# EAGLE design MJfoo - rev.1 - TCAN334 - poc (EAGLE 9.6.2)
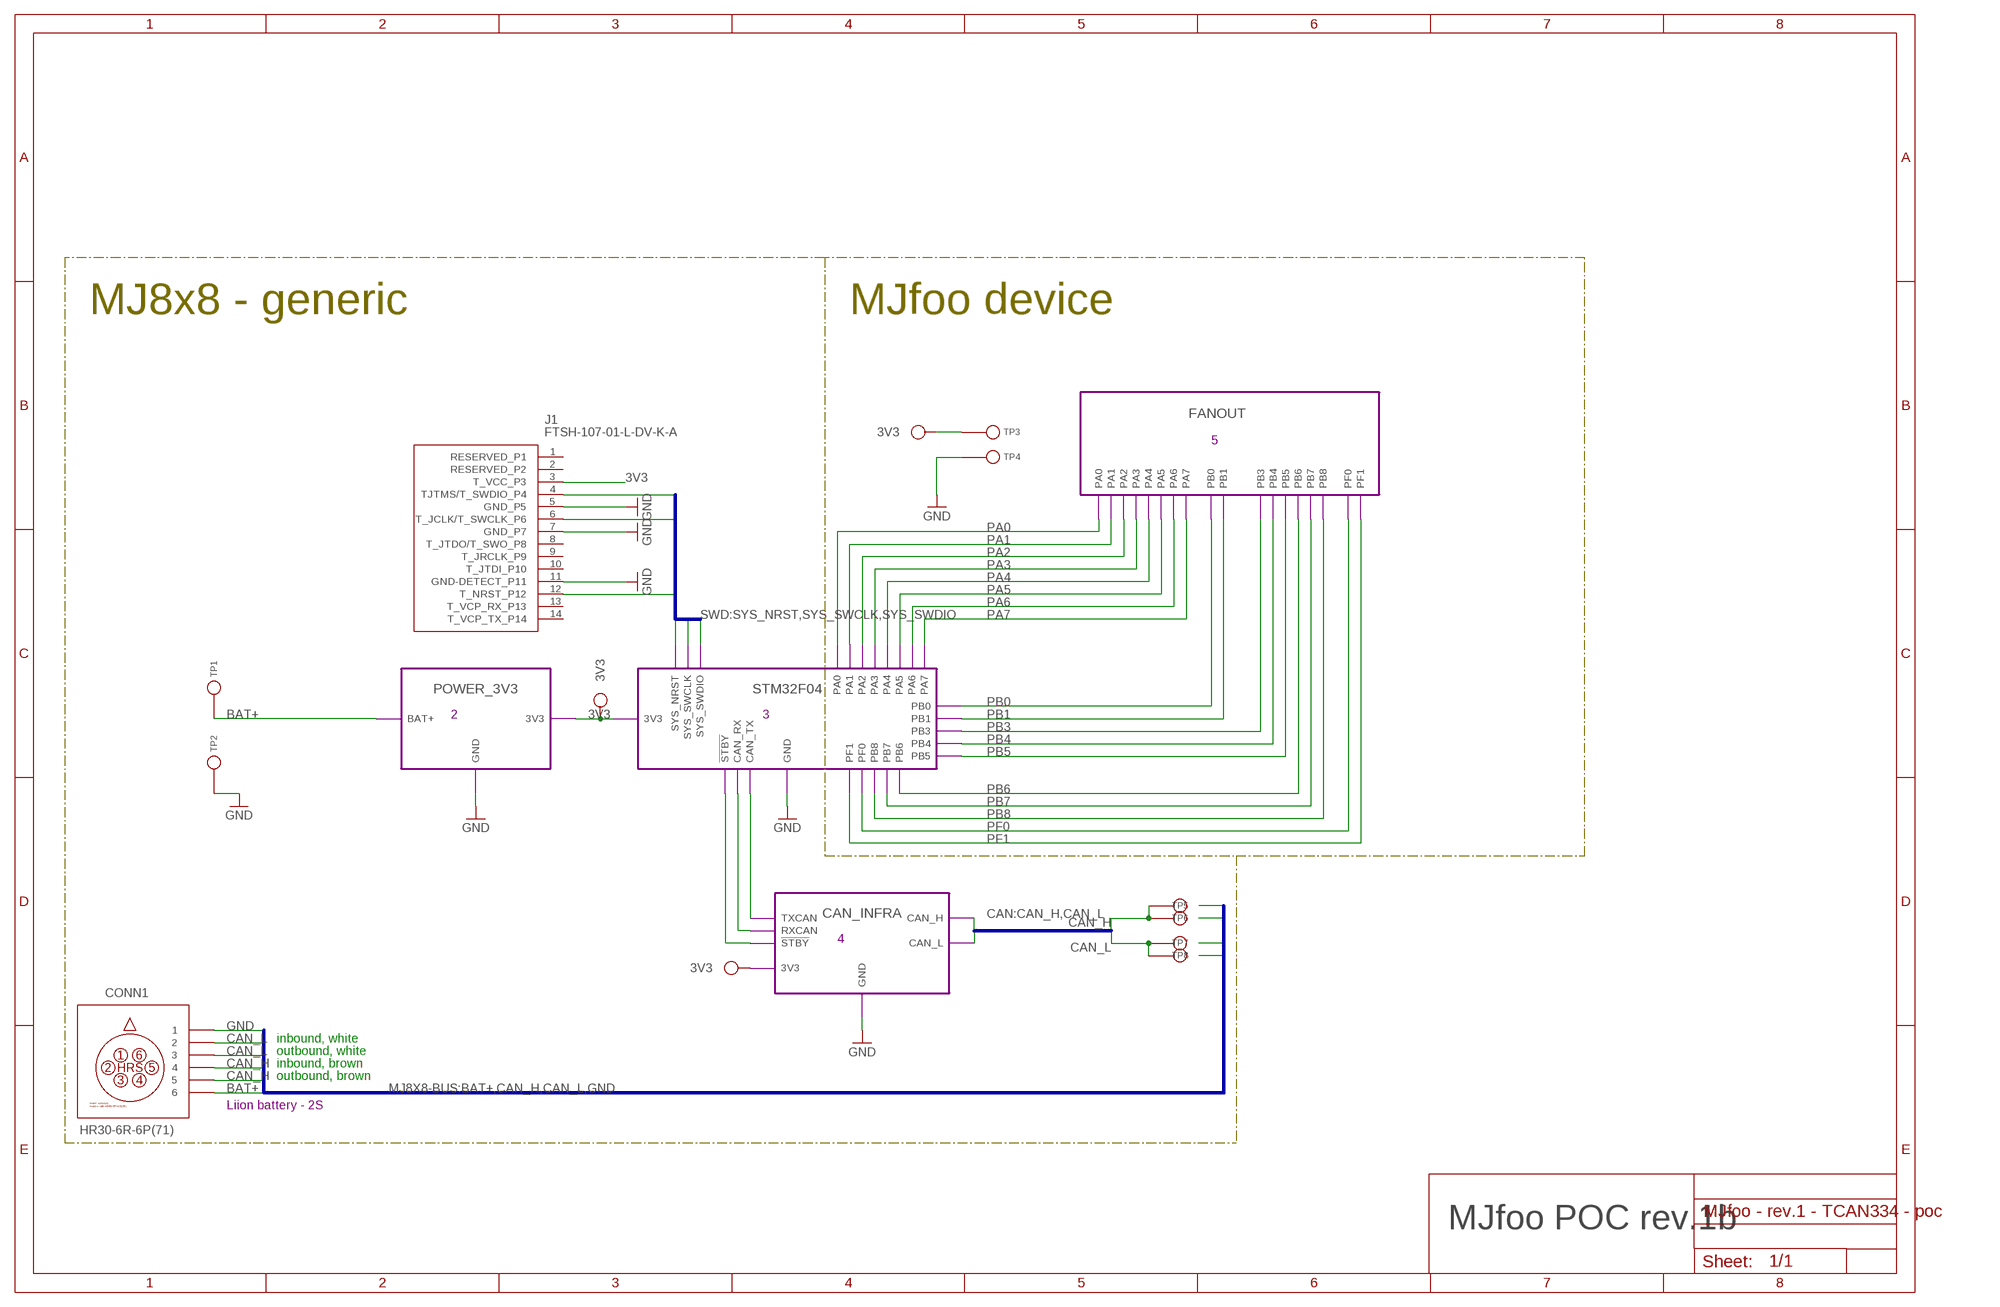
[diagram p0: schematic, sheet 1]

## Parts
CONN1  HR30-6R-6P(71)  HR-30-6R-6X  (no package)
J1  FTSH-107-01-L-DV-K-A  [FTSH10701LDVKA]
TP1  LiIon + Terminal  TPTH-0.9  [TH-0.9]
TP2  LiIon - Terminal  TPTH-0.9  [TH-0.9]
TP3  LiIon - Terminal  TPTH-0.9  [TH-0.9]
TP4  LiIon - Terminal  TPTH-0.9  [TH-0.9]
TP5  CAN high  TPTH-0.9  [TH-0.9]
TP6  CAN high  TPTH-0.9  [TH-0.9]
TP7  CAN low  TPTH-0.9  [TH-0.9]
TP8  CAN low  TPTH-0.9  [TH-0.9]

## Module instances
POWER_3V3 = POWER_3V3 (part numbers offset by 200)
STM32F04 = STM32 (part numbers offset by 300)
CAN_INFRA = CAN_INFRA (part numbers offset by 400)
FANOUT = FANOUT (part numbers offset by 500)

## Nets
3V3 [3V3]: J1.3(T_VCC_P3) TP3.P$1(TP$1) ; port CAN_INFRA.3V3 POWER_3V3.3V3 STM32F04.3V3
!STBY! [signal]: port CAN_INFRA.!STBY! STM32F04.!STBY!
BAT+ [BAT+]: CONN1.6 TP1.P$1(TP$1) ; port POWER_3V3.BAT+
CAN_H [signal]: CONN1.4 CONN1.5 TP5.P$1(TP$1) TP6.P$1(TP$1) ; port CAN_INFRA.CAN_H
CAN_L [signal]: CONN1.2 CONN1.3 TP7.P$1(TP$1) TP8.P$1(TP$1) ; port CAN_INFRA.CAN_L
CAN_RX [signal]: port CAN_INFRA.RXCAN STM32F04.CAN_RX
CAN_TX [signal]: port CAN_INFRA.TXCAN STM32F04.CAN_TX
GND: CONN1.1 J1.5(GND_P5) J1.7(GND_P7) J1.11(GND-DETECT_P11) TP2.P$1(TP$1) TP4.P$1(TP$1) ; port STM32F04.GND POWER_3V3.GND CAN_INFRA.GND
PA0 [signal]: port FANOUT.PA0 STM32F04.PA0
PA1 [signal]: port STM32F04.PA1 FANOUT.PA1
PA2 [signal]: port FANOUT.PA2 STM32F04.PA2
PA3 [signal]: port FANOUT.PA3 STM32F04.PA3
PA4 [signal]: port FANOUT.PA4 STM32F04.PA4
PA5 [signal]: port FANOUT.PA5 STM32F04.PA5
PA6 [signal]: port FANOUT.PA6 STM32F04.PA6
PA7 [signal]: port FANOUT.PA7 STM32F04.PA7
PB0 [signal]: port FANOUT.PB0 STM32F04.PB0
PB1 [signal]: port STM32F04.PB1 FANOUT.PB1
PB3 [signal]: port STM32F04.PB3 FANOUT.PB3
PB4 [signal]: port STM32F04.PB4 FANOUT.PB4
PB5 [signal]: port STM32F04.PB5 FANOUT.PB5
PB6 [signal]: port FANOUT.PB6 STM32F04.PB6
PB7 [signal]: port FANOUT.PB7 STM32F04.PB7
PB8 [signal]: port FANOUT.PB8 STM32F04.PB8
PF0 [signal]: port FANOUT.PF0 STM32F04.PF0
PF1 [signal]: port FANOUT.PF1 STM32F04.PF1
SYS_NRST [signal]: J1.12(T_NRST_P12) ; port STM32F04.SYS_NRST
SYS_SWCLK [signal]: J1.6(T_JCLK/T_SWCLK_P6) ; port STM32F04.SYS_SWCLK
SYS_SWDIO [signal]: J1.4(TJTMS/T_SWDIO_P4) ; port STM32F04.SYS_SWDIO
Unconnected: J1.1(RESERVED_P1) J1.2(RESERVED_P2) J1.8(T_JTDO/T_SWO_P8) J1.9(T_JRCLK_P9) J1.10(T_JTDI_P10) J1.13(T_VCP_RX_P13) J1.14(T_VCP_TX_P14)

## Buses
CAN:CAN_H,CAN_L
SWD:SYS_NRST,SYS_SWCLK,SYS_SWDIO
MJ8X8-BUS:BAT+,CAN_H,CAN_L,GND

## Notes on the sheet
- MJ8x8 - generic | MJfoo device
- 5
- 2 | 3
- 4
- inbound, white
- outbound, white
- inbound, brown
- outbound, brown
- Liion battery - 2S
- MJfoo POC rev.1b

## Library data of the parts
CONN1 = HR30-6R-6P - PushPull Receptacle:HR-30-6R-6X
J1 = STM32 JTAG 1.27mm 14pin header:FTSH-107-01-L-DV-K-A: Headers & Wire Housings .050" Micro Terminal Strip Source: Datasheet <https://componentsearchengine.com/Datasheets/1/FTSH-107-01-L-DV-K-A.pdf>; DESCRIPTION: Headers & Wire Housings .050" Micro Terminal Strip; HEIGHT: 5.97mm; MANUFACTURER_NAME: SAMTEC; MANUFACTURER_PART_NUMBER: FTSH-107-01-L-DV-K-A; MOUSER_PART_NUMBER: 200-FTSH10701LDVKA; MOUSER_PRICE-STOCK: https://www.mouser.com/Search/Refine.aspx?Keyword=200-FTSH10701LDVKA
TP1-TP8 = signal testpoint:TP

## Module POWER_3V3
Ports: GND(pwr) BAT+(pwr) 3V3(pwr)
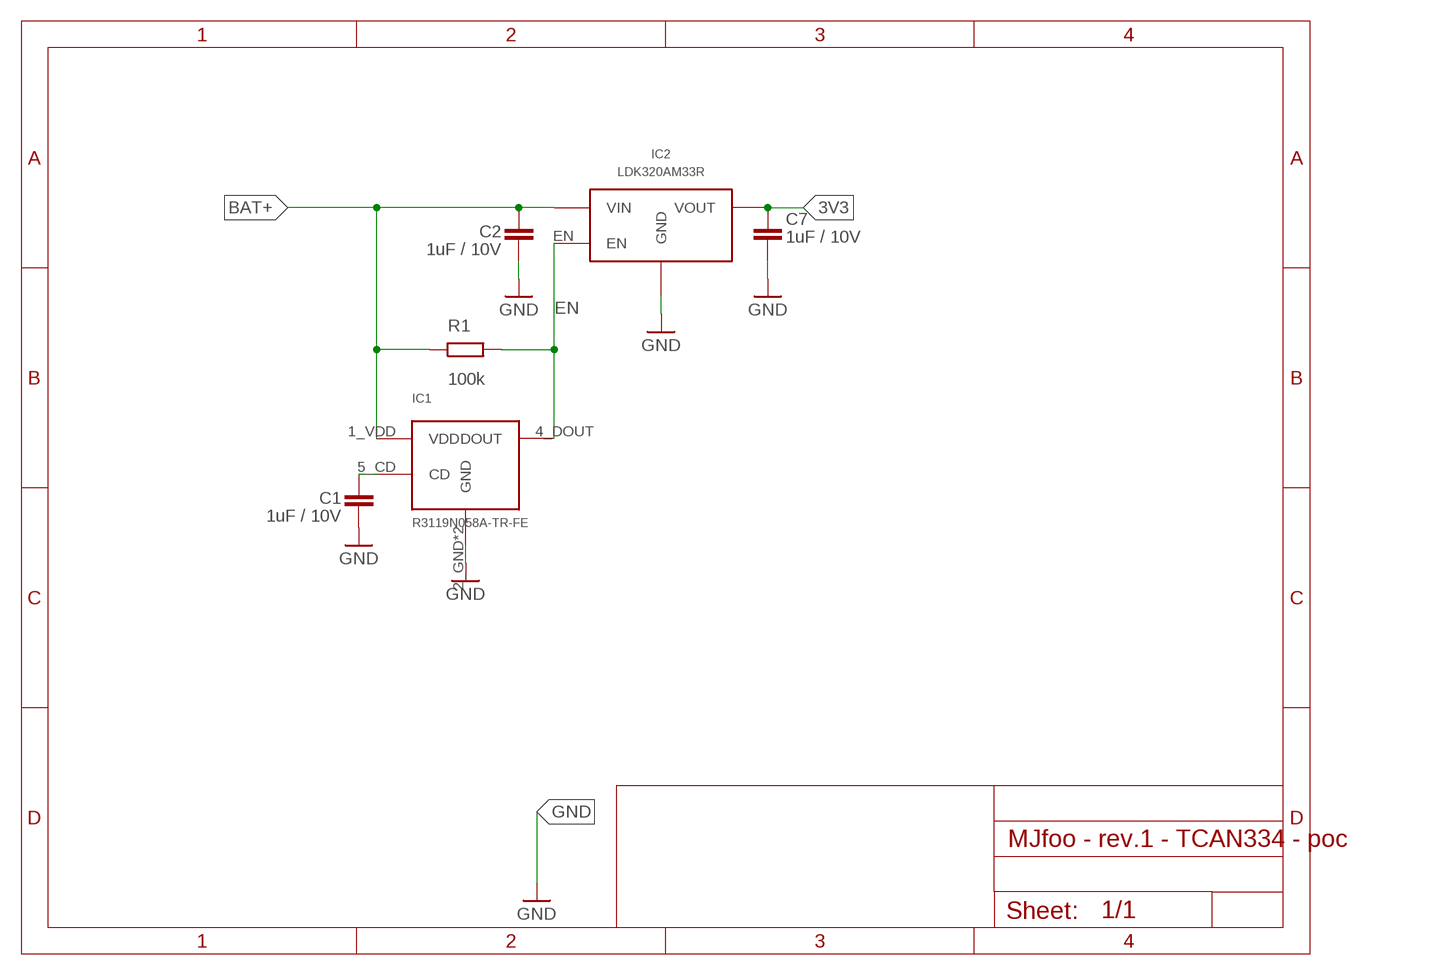
[diagram p1: schematic, module POWER_3V3, sheet 1]

### Parts
C1  1uF / 10V  C-EUC0402  [C0402]
C2  1uF / 10V  C-EUC0402  [C0402]
C7  1uF / 10V  C-EUC0402  [C0402]
IC1  R3119N058A-TR-FE  R3119XXXA  [SOT23-5]
IC2  LDK320AM33R  LDK320SOT-23-5L  [SOT-23-5L]
R1  100k  R-EU_R0402  [R0402]

### Nets
3V3 [3V3]: C7.2 IC2.OUT(VOUT)
BAT+ [BAT+]: C2.1 IC1.1_VDD(VDD) IC2.IN(VIN) R1.1
CD [signal]: C1.1 IC1.5_CD(CD)
EN [signal]: IC1.4_DOUT(DOUT) IC2.EN R1.2
GND: C1.2 C2.2 C7.1 IC1.2_GND(GND) IC1.3_GND(GND) IC2.GND

### Library data of the parts
C1 C2 C7 = rcl:C-EU: CAPACITOR, European symbol; SPICEPREFIX: C
IC1 = R3119x - Input Voltage Detector:R3119XXXA
IC2 = LDK320 5V LDO:LDK320
R1 = rcl:R-EU_: RESISTOR, European symbol; SPICEPREFIX: R

## Module STM32
Ports: GND(pwr) 3V3(pwr) SYS_NRST(in) SYS_SWCLK(io) SYS_SWDIO(io) CAN_RX(in) CAN_TX(out) !STBY!(out) PA0(io) PA1(io) PA2(io) PA3(io) PA4(io) PA5(io) PA6(io) PA7(io) PB0(io) PB1(io) PB3(io) PB4(io) PB5(io) PB6(io) PB7(io) PB8(io) PF0(io) PF1(io)
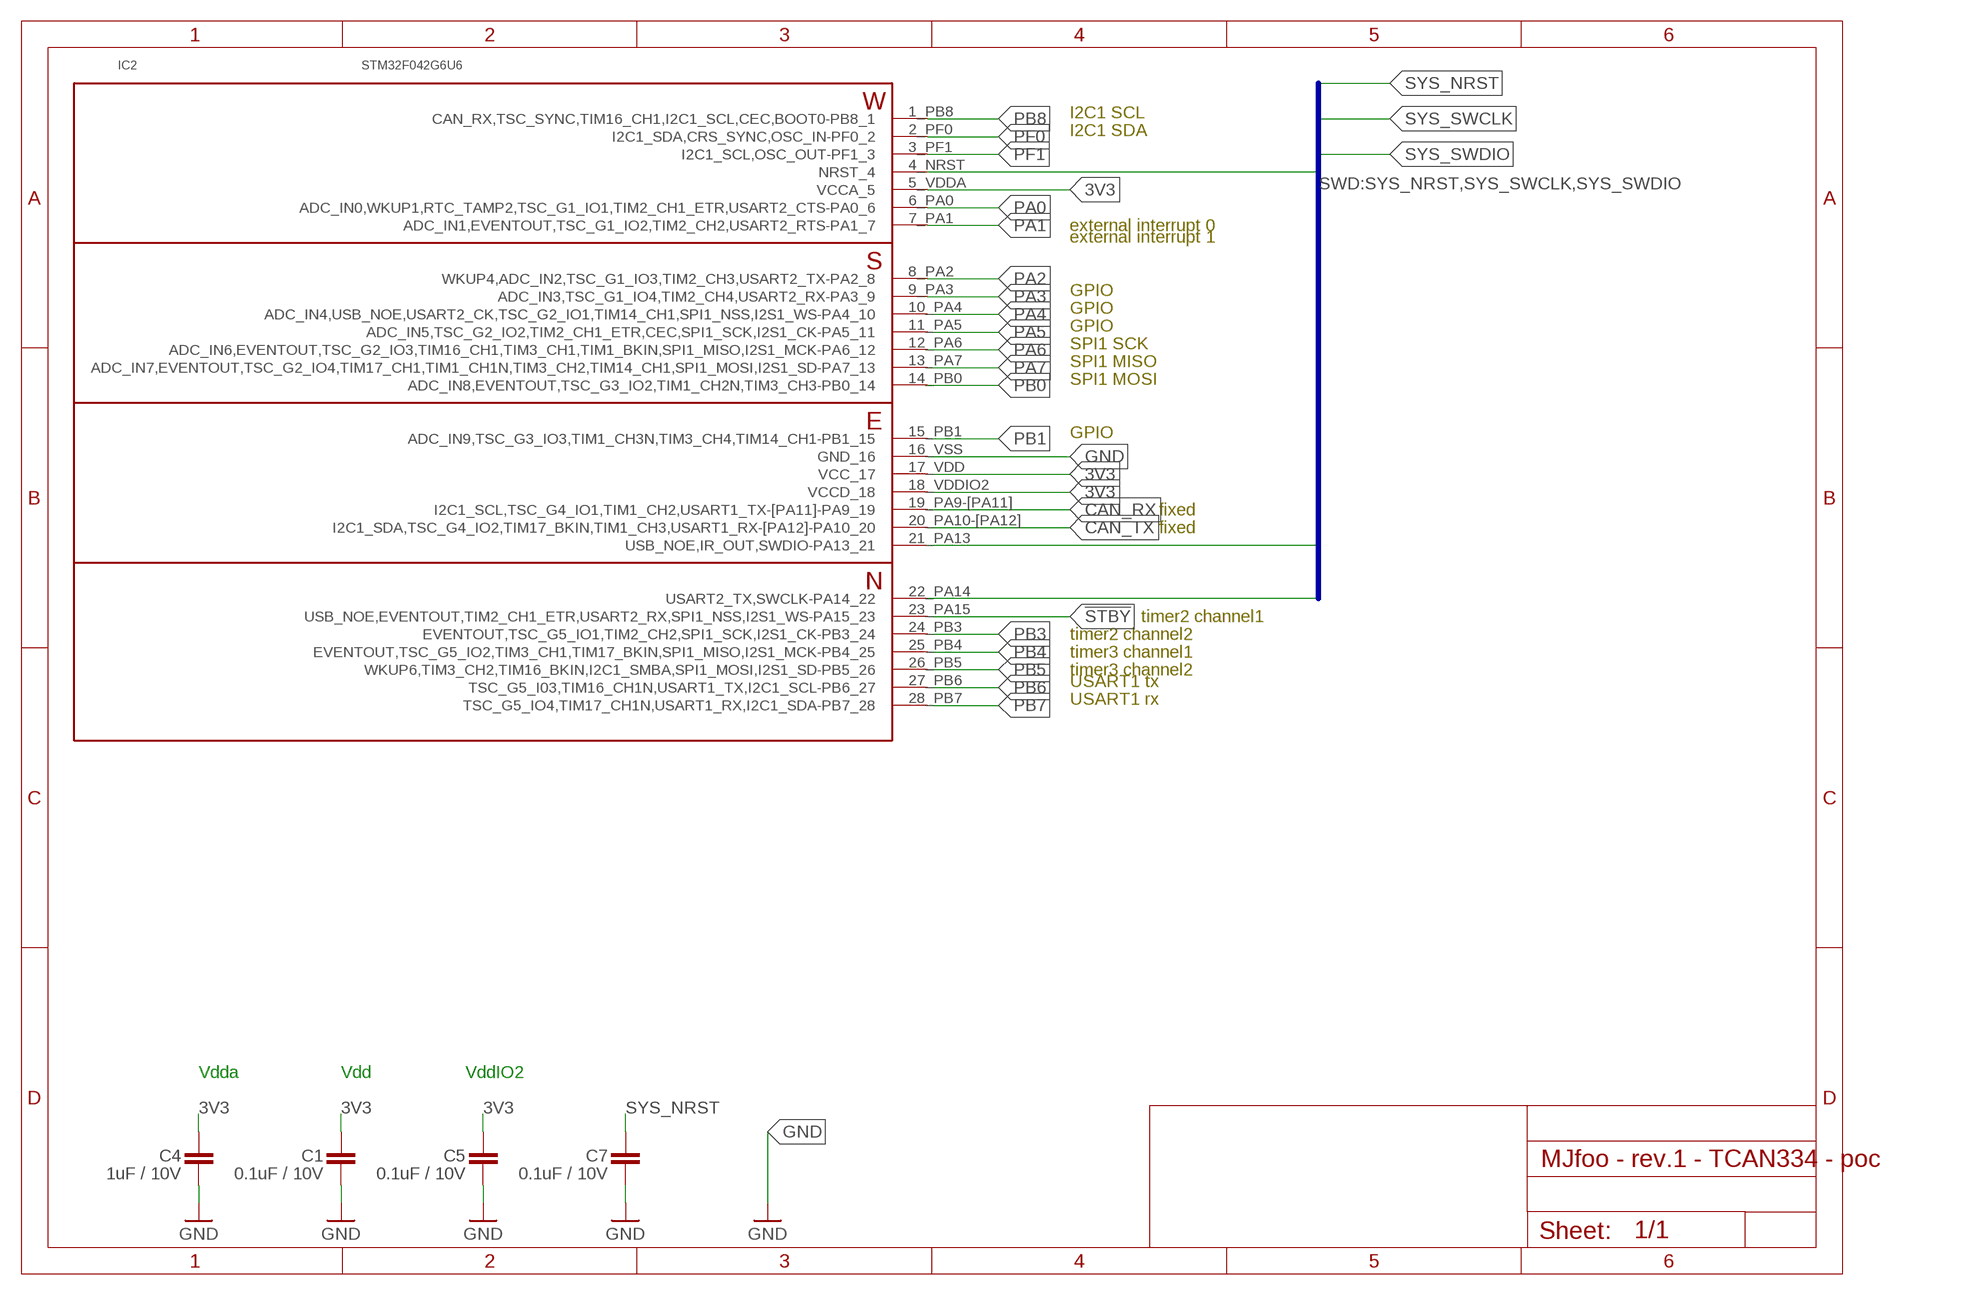
[diagram p2: schematic, module STM32, sheet 1]

### Parts
C1  0.1uF / 10V  C-EUC0402  [C0402]
C4  1uF / 10V  C-EUC0402  [C0402]
C5  0.1uF / 10V  C-EUC0402  [C0402]
C7  0.1uF / 10V  C-EUC0402  [C0402]
IC2  STM32F042G6U6  STM32F042G6  [UFQFPN-28]

### Nets
3V3 [3V3]: C1.2 C4.2 C5.2 IC2.5_VDDA(VCCA_5) IC2.17_VDD(VCC_17) IC2.18_VDDIO2(VCCD_18)
!STBY!: IC2.23_PA15(USB_NOE,EVENTOUT,TIM2_CH1_ETR,USART2_RX,SPI1_NSS,I2S1_WS-PA15_23)
CAN_RX: IC2.19_PA9-[PA11](I2C1_SCL,TSC_G4_IO1,TIM1_CH2,USART1_TX-[PA11]-PA9_19)
CAN_TX: IC2.20_PA10-[PA12](I2C1_SDA,TSC_G4_IO2,TIM17_BKIN,TIM1_CH3,USART1_RX-[PA12]-PA10_20)
GND: C1.1 C4.1 C5.1 C7.1 IC2.16_VSS(GND_16)
PA0: IC2.6_PA0(ADC_IN0,WKUP1,RTC_TAMP2,TSC_G1_IO1,TIM2_CH1_ETR,USART2_CTS-PA0_6)
PA1: IC2.7_PA1(ADC_IN1,EVENTOUT,TSC_G1_IO2,TIM2_CH2,USART2_RTS-PA1_7)
PA2: IC2.8_PA2(WKUP4,ADC_IN2,TSC_G1_IO3,TIM2_CH3,USART2_TX-PA2_8)
PA3: IC2.9_PA3(ADC_IN3,TSC_G1_IO4,TIM2_CH4,USART2_RX-PA3_9)
PA4: IC2.10_PA4(ADC_IN4,USB_NOE,USART2_CK,TSC_G2_IO1,TIM14_CH1,SPI1_NSS,I2S1_WS-PA4_10)
PA5: IC2.11_PA5(ADC_IN5,TSC_G2_IO2,TIM2_CH1_ETR,CEC,SPI1_SCK,I2S1_CK-PA5_11)
PA6: IC2.12_PA6(ADC_IN6,EVENTOUT,TSC_G2_IO3,TIM16_CH1,TIM3_CH1,TIM1_BKIN,SPI1_MISO,I2S1_MCK-PA6_12)
PA7: IC2.13_PA7(ADC_IN7,EVENTOUT,TSC_G2_IO4,TIM17_CH1,TIM1_CH1N,TIM3_CH2,TIM14_CH1,SPI1_MOSI,I2S1_SD-PA7_13)
PB0: IC2.14_PB0(ADC_IN8,EVENTOUT,TSC_G3_IO2,TIM1_CH2N,TIM3_CH3-PB0_14)
PB1: IC2.15_PB1(ADC_IN9,TSC_G3_IO3,TIM1_CH3N,TIM3_CH4,TIM14_CH1-PB1_15)
PB3: IC2.24_PB3(EVENTOUT,TSC_G5_IO1,TIM2_CH2,SPI1_SCK,I2S1_CK-PB3_24)
PB4: IC2.25_PB4(EVENTOUT,TSC_G5_IO2,TIM3_CH1,TIM17_BKIN,SPI1_MISO,I2S1_MCK-PB4_25)
PB5: IC2.26_PB5(WKUP6,TIM3_CH2,TIM16_BKIN,I2C1_SMBA,SPI1_MOSI,I2S1_SD-PB5_26)
PB6: IC2.27_PB6(TSC_G5_I03,TIM16_CH1N,USART1_TX,I2C1_SCL-PB6_27)
PB7: IC2.28_PB7(TSC_G5_IO4,TIM17_CH1N,USART1_RX,I2C1_SDA-PB7_28)
PB8: IC2.1_PB8(CAN_RX,TSC_SYNC,TIM16_CH1,I2C1_SCL,CEC,BOOT0-PB8_1)
PF0: IC2.2_PF0(I2C1_SDA,CRS_SYNC,OSC_IN-PF0_2)
PF1: IC2.3_PF1(I2C1_SCL,OSC_OUT-PF1_3)
SYS_NRST: C7.2 IC2.4_NRST(NRST_4)
SYS_SWCLK: IC2.22_PA14(USART2_TX,SWCLK-PA14_22)
SYS_SWDIO: IC2.21_PA13(USB_NOE,IR_OUT,SWDIO-PA13_21)

### Buses
SWD:SYS_NRST,SYS_SWCLK,SYS_SWDIO

### Notes on the sheet
- I2C1 SCL
- I2C1 SDA
- external interrupt 0
- external interrupt 1
- GPIO
- GPIO
- GPIO
- SPI1 SCK
- SPI1 MISO
- SPI1 MOSI
- GPIO
- fixed
- fixed
- timer2 channel1
- timer2 channel2
- timer3 channel1
- timer3 channel2
- USART1 tx
- USART1 rx
- Vdda | Vdd | VddIO2

### Library data of the parts
C1 C4 C5 C7 = rcl:C-EU: CAPACITOR, European symbol; SPICEPREFIX: C
IC2 = STM32F042G6:STM32F042G6

## Module CAN_INFRA
Ports: GND(pwr) 3V3(pwr) CAN_H(io) CAN_L(io) TXCAN(in) RXCAN(out) !STBY!(in)
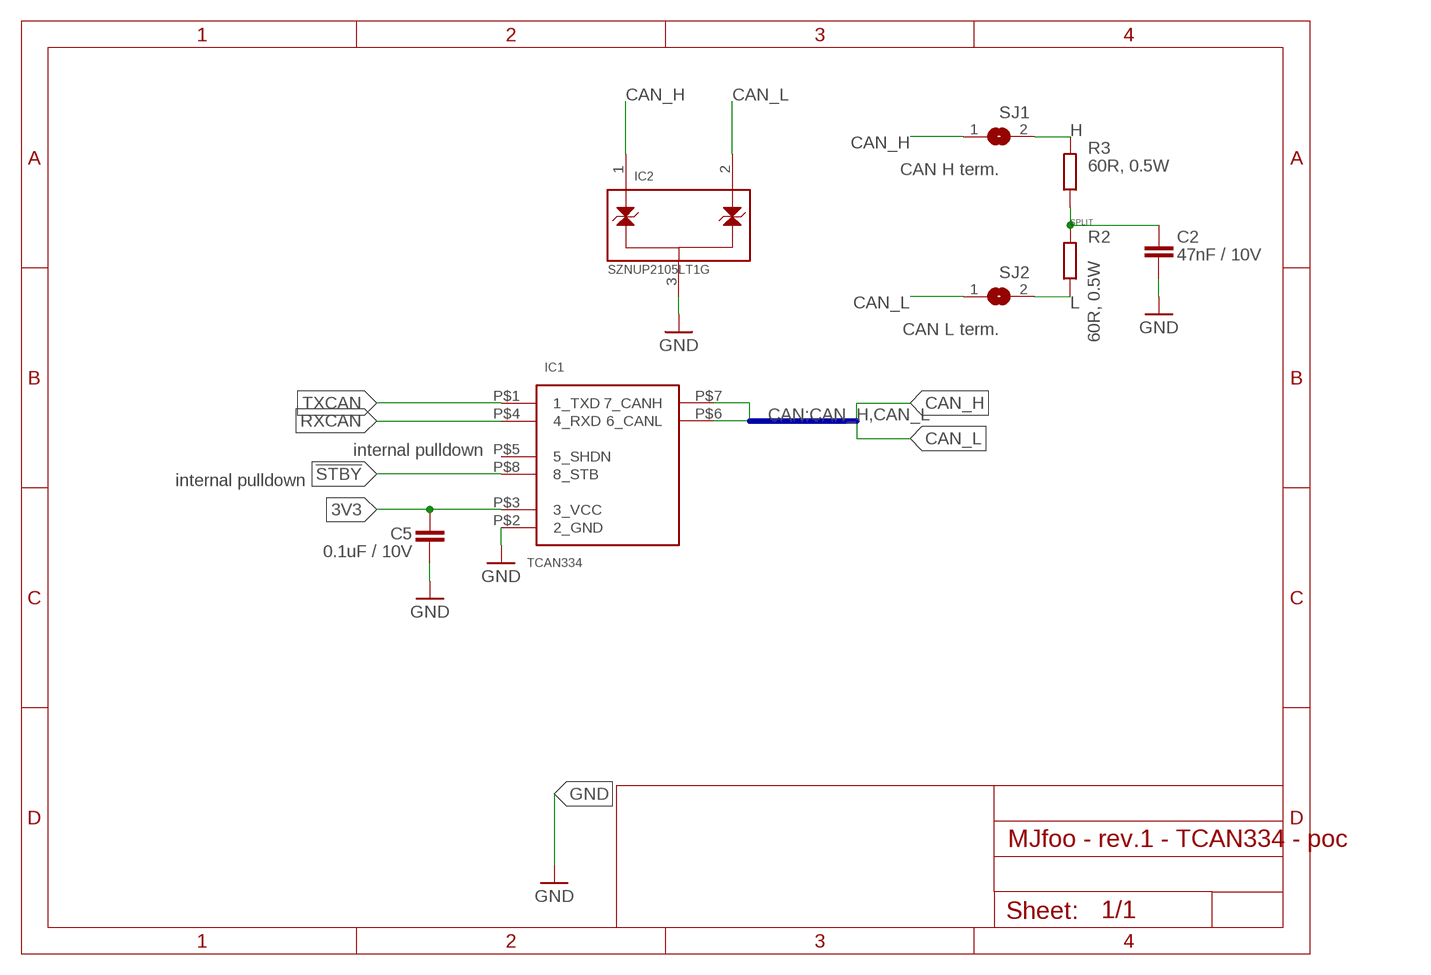
[diagram p3: schematic, module CAN_INFRA, sheet 1]

### Parts
C2  47nF / 10V  C-EUC0402  [C0402]
C5  0.1uF / 10V  C-EUC0402  [C0402]
IC1  TCAN334  CAN33X  [SOT23-8]
IC2  SZNUP2105LT1G  NUP2105L  [SOT-23-3]
R2  60R, 0.5W  R-EU_R0805  [R0805]
R3  60R, 0.5W  R-EU_R0805  [R0805]
SJ1  CAN H term.  SJ  [SJ]
SJ2  CAN L term.  SJ  [SJ]

### Nets
3V3 [3V3]: C5.1 IC1.P$3(3_VCC)
!STBY! [signal]: IC1.P$8(8_STB)
CAN_H [signal]: IC1.P$7(7_CANH) IC2.1(PIN1) SJ1.1
CAN_L [signal]: IC1.P$6(6_CANL) IC2.2(PIN2) SJ2.1
GND: C2.2 C5.2 IC1.P$2(2_GND) IC2.3(PIN3)
H [signal]: R3.2 SJ1.2
L [signal]: R2.1 SJ2.2
RXCAN [signal]: IC1.P$4(4_RXD)
SPLIT [signal]: C2.1 R2.2 R3.1
TXCAN [signal]: IC1.P$1(1_TXD)
Unconnected: IC1.P$5(5_SHDN)

### Buses
CAN:CAN_H,CAN_L

### Notes on the sheet
- internal pulldown
- internal pulldown

### Library data of the parts
C2 C5 = rcl:C-EU: CAPACITOR, European symbol; SPICEPREFIX: C
IC1 = TCAN33x - 3.3V CAN Transciever:CAN33X
IC2 = NUP2105L - 27V ESD Protection Diode:NUP2105L
R2 R3 = rcl:R-EU_: RESISTOR, European symbol; SPICEPREFIX: R
SJ1 SJ2 = jumper:SJ: SMD solder JUMPER

## Module FANOUT
Ports: PA0(io) PA1(io) PA2(io) PA3(io) PA4(io) PA5(io) PA6(io) PA7(io) PB0(io) PB1(io) PB3(io) PB4(io) PB5(io) PB6(io) PB7(io) PB8(io) PF0(io) PF1(io)
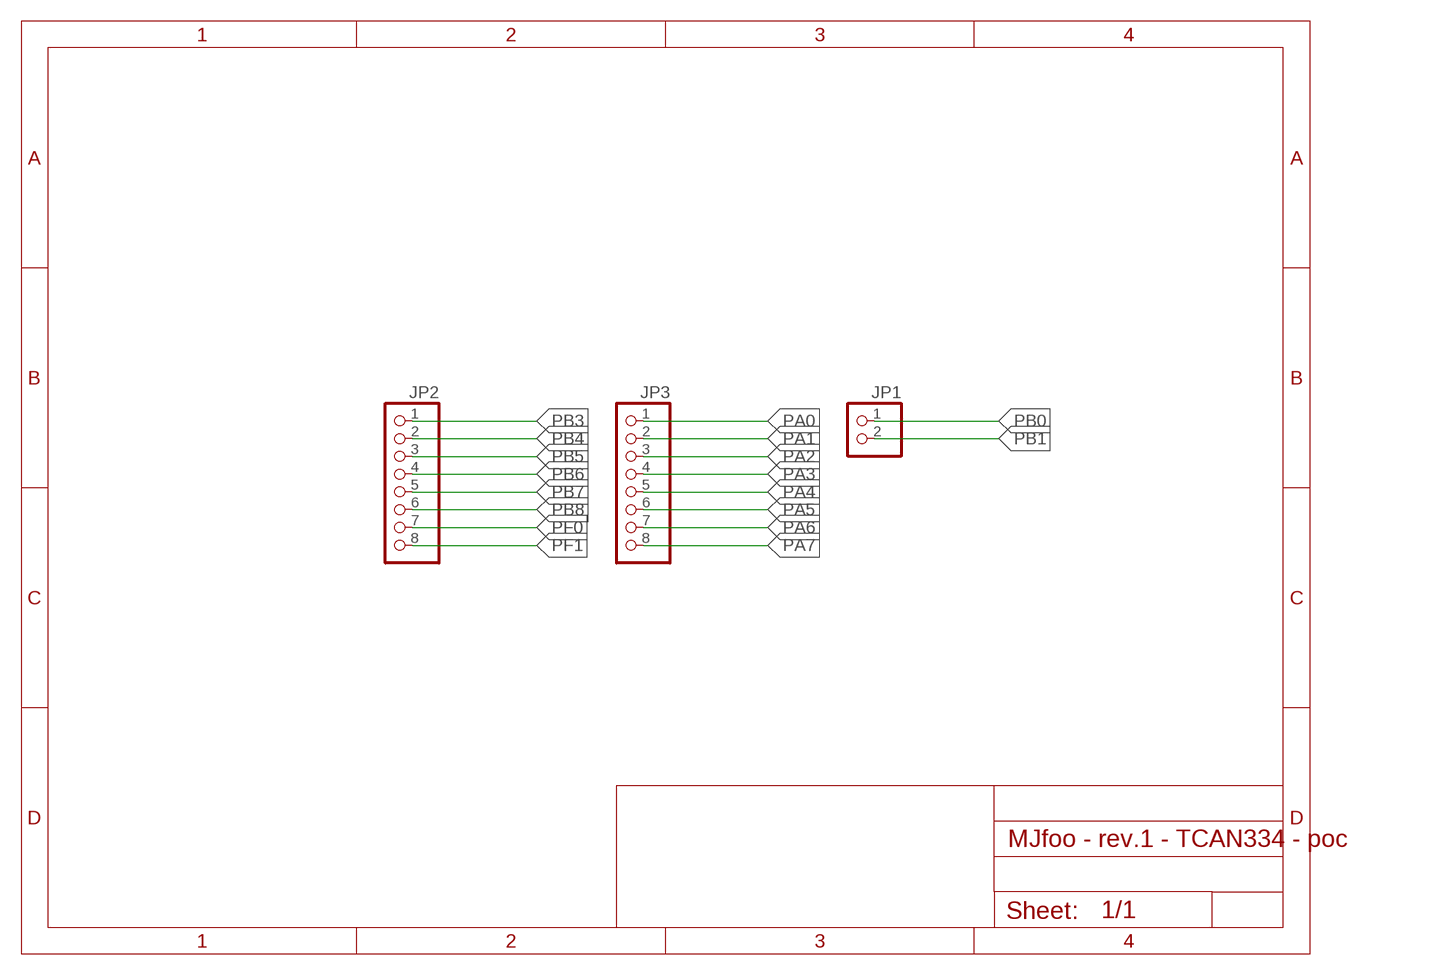
[diagram p4: schematic, module FANOUT, sheet 1]

### Parts
JP1  PINHD-1X2  [1X02]
JP2  PINHD-1X8  [1X08]
JP3  PINHD-1X8  [1X08]

### Nets
PA0 [signal]: JP3.1
PA1 [signal]: JP3.2
PA2 [signal]: JP3.3
PA3 [signal]: JP3.4
PA4 [signal]: JP3.5
PA5 [signal]: JP3.6
PA6 [signal]: JP3.7
PA7 [signal]: JP3.8
PB0 [signal]: JP1.1
PB1 [signal]: JP1.2
PB3 [signal]: JP2.1
PB4 [signal]: JP2.2
PB5 [signal]: JP2.3
PB6 [signal]: JP2.4
PB7 [signal]: JP2.5
PB8 [signal]: JP2.6
PF0 [signal]: JP2.7
PF1 [signal]: JP2.8

### Library data of the parts
JP1 = pinhead:PINHD-1X2: PIN HEADER
JP2 JP3 = pinhead:PINHD-1X8: PIN HEADER

## Net classes
0 GND: width 0.25 mm, drill 0.35 mm, clearance 0.19 mm
1 BAT+: width 0.5 mm, drill 0.35 mm, clearance 0.19 mm
3 signal: width 0.25 mm, drill 0.35 mm, clearance 0.19 mm
4 3V3: width 0.25 mm, drill 0.35 mm, clearance 0.19 mm

## Board
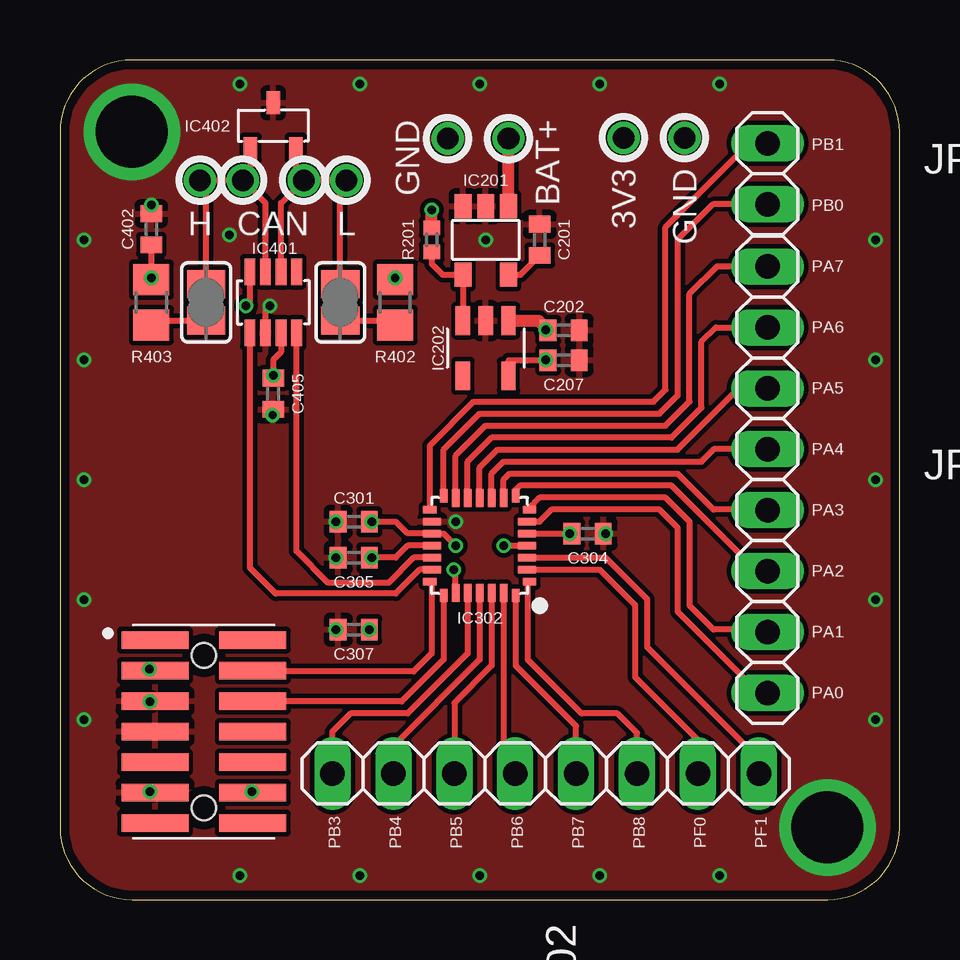
[diagram p5: board, top side]
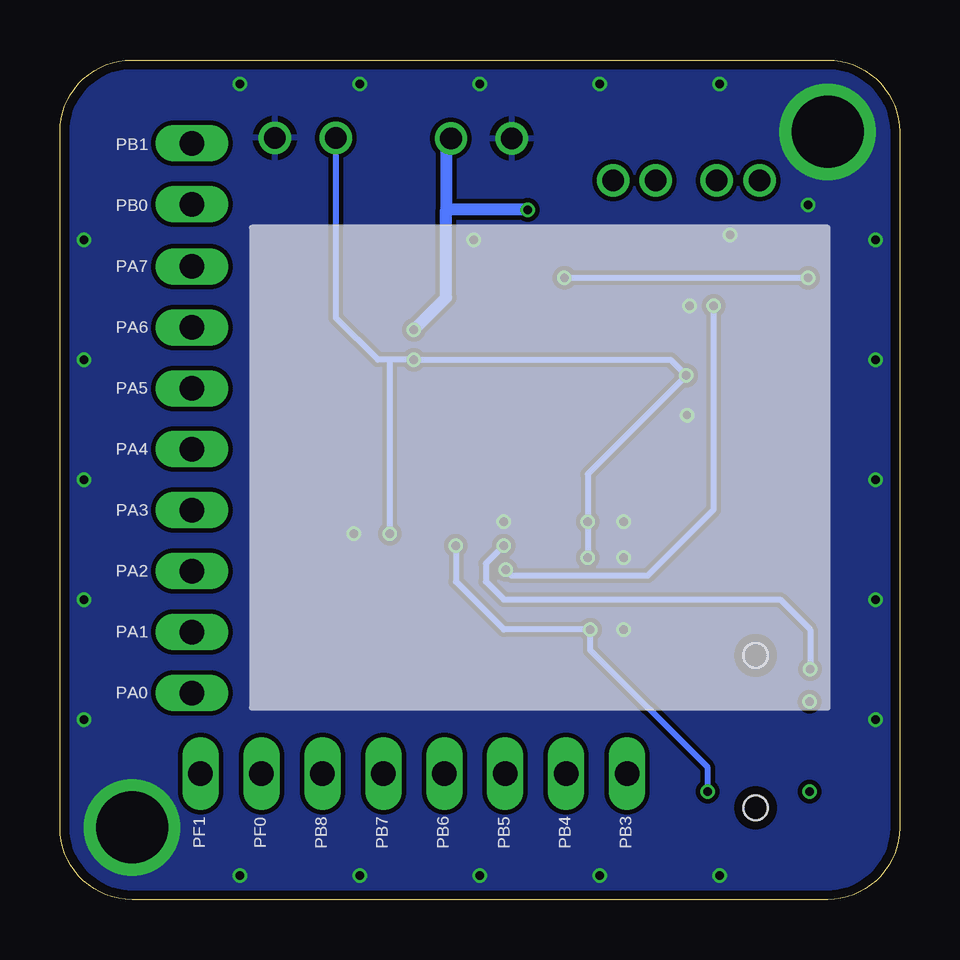
[diagram p6: board, bottom side, seen from below]

Size 35 x 35 mm. Coordinates in mm from the lower left corner, seen from the top.
Outline: 0,32 0,3 arc90 3,0 32,0 arc90 35,3 35,32 arc90 32,35 3,35 arc90 0,32
Copper layers (1*16): Top 0.035559375mm / dielectric 1.6mm / Bottom 0.035559375mm
Design rules "oshpark-2layer": minimum track width 6mil, minimum drill 10mil, track to track 6mil, track to pad 6mil, pad to pad 6mil, via to via 6mil, smd to smd 6mil, copper to edge 15mil, drill to drill 6mil, minimum pad ring 5mil, minimum via ring 5mil, stop-mask expansion 2.5mil, vias tented up to drill 0mil, thermal gap 10mil

### Footprints (pad centres in the part's own frame; a part is rotated, then mirrored left to right if it is on the bottom)
C0402 = smd 0.7 x 0.9: 1 -0.65,0; 2 0.65,0
SOT23-5 = smd 0.7 x 1: 1_VDD -0.95,-1.4; 2_GND 0,-1.4; 3_GND 0.95,-1.4; 4_DOUT 0.95,1.45; 5_CD -0.95,1.45
SOT-23-5L = smd 0.6 x 1.2: ADJ/NC -0.95,-1.15; EN -0.95,1.15; GND 0,1.15; IN 0.95,1.15; OUT 0.95,-1.15
UFQFPN-28 = smd 0.55 x 0.3: 1_PB8 -2.08,1.5; 7_PA1 -2.08,-1.5; 15_PB1 2.08,-1.5; 21_PA13 2.08,1.5 | smd 0.75 x 0.3: 2_PF0 -1.98,1; 3_PF1 -1.98,0.5; 4_NRST -1.98,0; 5_VDDA -1.98,-0.5; 6_PA0 -1.98,-1; 16_VSS 1.98,-1; 17_VDD 1.98,-0.5; 18_VDDIO2 1.98,0; 19_PA9-[PA11] 1.98,0.5; 20_PA10-[PA12] 1.98,1 | smd 0.3 x 0.55: 8_PA2 -1.5,-2.08; 14_PB0 1.5,-2.08; 22_PA14 1.5,2.08; 28_PB7 -1.5,2.08 | smd 0.3 x 0.75: 9_PA3 -1,-1.98; 10_PA4 -0.5,-1.98; 11_PA5 0,-1.98; 12_PA6 0.5,-1.98; 13_PA7 1,-1.98; 23_PA15 1,1.98; 24_PB3 0.5,1.98; 25_PB4 0,1.98; 26_PB5 -0.5,1.98; 27_PB6 -1,1.98
SOT23-8 = smd 0.45 x 1.1: P$1 -0.975,-1.275; P$2 -0.325,-1.275; P$3 0.325,-1.275; P$4 0.975,-1.275; P$5 0.975,1.275; P$6 0.325,1.275; P$7 -0.325,1.275; P$8 -0.975,1.275
SOT-23-3 = smd 0.56 x 0.95: 1 -0.95,-0.95; 2 0.95,-0.95; 3 0,0.95
FTSH10701LDVKA = smd 0.74 x 2.79: 1 -3.81,-2.035; 2 -3.81,2.035; 3 -2.54,-2.035; 4 -2.54,2.035; 5 -1.27,-2.035; 6 -1.27,2.035; 7 0,-2.035; 8 0,2.035; 9 1.27,-2.035; 10 1.27,2.035; 11 2.54,-2.035; 12 2.54,2.035; 13 3.81,-2.035; 14 3.81,2.035 | hole 1.02: -3.175,0; 3.175,0
1X02 = drill 1.016 long: 1 -1.27,0; 2 1.27,0
1X08 = drill 1.016 long: 1 -8.89,0; 2 -6.35,0; 3 -3.81,0; 4 -1.27,0; 5 1.27,0; 6 3.81,0; 7 6.35,0; 8 8.89,0
R0402 = smd 0.6 x 0.7: 1 -0.5,0; 2 0.5,0
R0805 = smd 1.3 x 1.5: 1 -0.95,0; 2 0.95,0
SJ = smd 1.168 x 1.6: 1 -0.762,0; 2 0.762,0
TH-0.9 = drill 0.9: P$1 0,0

### Placement (x,y rotation side)
C201  1uF / 10V  [C0402]  20,27.5 90 top
C202  1uF / 10V  [C0402]  21,23.73 0 top
C207  1uF / 10V  [C0402]  21,22.48 180 top
C301  0.1uF / 10V  [C0402]  12.25,15.75 0 top
C304  1uF / 10V  [C0402]  22,15.25 180 top
C305  0.1uF / 10V  [C0402]  12.25,14.25 0 top
C307  0.1uF / 10V  [C0402]  12.25,11.25 0 top
C402  47nF / 10V  [C0402]  3.81,27.94 90 top
C405  0.1uF / 10V  [C0402]  8.89,21.08 270 top
IC201  R3119N058A-TR-FE  [SOT23-5]  17.75,27.5 180 top
IC202  LDK320AM33R  [SOT-23-5L]  17.75,22.98 0 top
IC302  STM32F042G6U6  [UFQFPN-28]  17.5,14.75 180 top
IC401  TCAN334  [SOT23-8]  8.89,24.89 0 top
IC402  SZNUP2105LT1G  [SOT-23-3]  8.89,32.26 0 top
J1  6,7 270 top
JP501  [1X02]  29.5,30.25 90 top
JP502  [1X08]  20.25,5.25 0 top
JP503  [1X08]  29.5,17.5 90 top
R201  100k  [R0402]  15.5,27.5 270 top
R402  60R, 0.5W  [R0805]  13.97,24.89 90 top
R403  60R, 0.5W  [R0805]  3.81,24.89 270 top
SJ401  CAN H term.  [SJ]  6.09,24.89 270 top
SJ402  CAN L term.  [SJ]  11.68,24.89 270 top
TP1  18.7,31.72 0 top
TP2  16.16,31.72 0 top
TP3  23.49,31.75 0 top
TP4  26.03,31.75 0 top
TP5  7.62,29.98 0 top
TP6  5.84,29.98 0 top
TP7  11.94,29.98 0 top
TP8  10.16,29.98 0 top

### Tracks (layer width: path | path; a pad name or v marks a point on that pad's centre or on a via)
3V3  (via drill 0.35)
  Top 0.25: J1.3 3.79,9.54 v3.73,9.6 | IC401.P$3 9.21,22.82 8.89,22.5 v8.89,21.85 C405.1 | IC302.18_VDDIO2 14.5,14.75 14,14.25 v13,14.25 C305.2 | v16.5,14.75 16,15.25 IC302.17_VDD 15.48,15.29 14.46,15.29 14,15.75 v13,15.75 C301.2 | 20.27,22.48 v20.25,22.5 | IC202.OUT 18.7,22.47 18.71,22.48 20.27,22.48 | IC302.5_VDDA v21.25,15.25 C304.2 | C207.2 20.27,22.48
  Bottom 0.25: v3.73,9.6 3.73,11.25 4.98,12.5 16.5,12.5 17.25,13.25 17.25,14 v16.5,14.75 | v13,14.25 v13,15.75 13,17.74 v8.89,21.85 9.54,22.5 v20.25,22.5 21.25,22.5 | v21.25,15.25 21.25,22.5 | TP3.P$1 23.49,24.25 21.75,22.5 21.25,22.5
!STBY!  (via drill 0.35)
  Top 0.25: IC302.23_PA15 16.5,13.67 v16.42,13.75 | IC401.P$8 7.91,24.92 v7.75,24.75
  Bottom 0.25: v16.42,13.75 16.17,13.5 10.5,13.5 7.75,16.25 v7.75,24.75
BAT+  (via drill 0.35)
  Top 0.5: IC201.1_VDD TP1.P$1 | R201.1 v15.5,28.75 | IC202.IN 19.95,24.13 C202.1 20.33,23.75 v20.25,23.75
  Bottom 0.5: v20.25,23.75 18.9,25.1 18.9,28.75 | v15.5,28.75 18.9,28.75 | TP1.P$1 18.9,31.52 18.9,28.75
CAN_H
  Top 0.25: TP6.P$1 6.09,29.98 | 6.09,29.98 TP5.P$1 | TP5.P$1 7.94,30.3 IC402.1 | IC401.P$7 8.56,29.04 TP5.P$1 | SJ401.1 6.09,29.98
CAN_INFRA:H
  Top 0.25: R403.2 4,24.13 SJ401.2
CAN_INFRA:L
  Top 0.25: SJ402.2 13.78,24.13 R402.1
CAN_INFRA:SPLIT  (via drill 0.35)
  Top 0.25: C402.1 v3.81,25.91 R403.1 | R402.2 v13.97,25.91
  Bottom 0.25: v3.81,25.91 v13.97,25.91
CAN_L
  Top 0.25: TP7.P$1 11.68,29.98 | 11.68,29.98 TP8.P$1 | TP8.P$1 9.84,30.3 IC402.2 | IC401.P$6 9.21,29.04 TP8.P$1 | SJ402.1 11.68,29.98
CAN_RX
  Top 0.25: IC401.P$4 9.86,14.52 11.19,13.2 13.7,13.2 14.75,14.25 IC302.19_PA9-[PA11]
CAN_TX
  Top 0.25: IC302.20_PA10-[PA12] 15,13.75 14,12.75 9,12.75 7.91,13.84 IC401.P$1
GND  (via drill 0.35, 3)
  Top 0.25: C405.2 8.89,20.22 v8.86,20.2 | IC401.P$2 8.56,24.57 v8.75,24.75
  other vias: 3,32 32,3 34,17.5 1,17.5 1,12.5 1,7.5 1,22.5 1,27.5 17.5,1 22.5,1 27.5,1 12.5,1 7.5,1 34,12.5 34,7.5 34,22.5 34,27.5 17.5,34 22.5,34 27.5,34 12.5,34 7.5,34 16.5,15.75 17.75,27.5 22.75,15.25 11.5,15.75 11.5,14.25 11.5,11.25 3.81,28.96 7.06,27.71
  pour Top (rank 6): 0,35 35,35 35,0 0,0
  pour Bottom (rank 6): 0,35 35,35 35,0 0,0
N$2  (via drill 0.35)
  other vias: 3.75,4.5
N$3  (via drill 0.35)
  other vias: 3.75,8.25
PA0
  Top 0.25: JP503.1 29.39,8.5 29.25,8.5 25.75,12 25.75,15.5 25,16.25 20.5,16.25 20,15.75 IC302.6_PA0
PA1
  Top 0.25: JP503.2 29.4,11.25 27.25,11.25 26.25,12.25 26.25,15.75 25.25,16.75 20,16.75 19.58,16.33 IC302.7_PA1
PA2
  Top 0.25: JP503.3 29.44,13.75 29,13.75 25.5,17.25 19.17,17.25 19,17.08 IC302.8_PA2
PA3
  Top 0.25: JP503.4 29.48,16.25 27.25,16.25 25.75,17.75 18.75,17.75 18.5,17.5 IC302.9_PA3
PA4
  Top 0.25: IC302.10_PA4 18,17.75 18.5,18.25 26.75,18.25 27.27,18.77 JP503.5
PA5
  Top 0.25: IC302.11_PA5 17.5,18 18.25,18.75 25.75,18.75 28.25,21.25 29.44,21.25 JP503.6
PA6
  Top 0.25: IC302.12_PA6 17,18.25 18,19.25 25.5,19.25 26.75,20.5 26.75,23.25 27.35,23.85 JP503.7
PA7
  Top 0.25: IC302.13_PA7 16.5,18.5 17.75,19.75 25.25,19.75 26.25,20.75 26.25,25.25 27.39,26.39 JP503.8
PB0
  Top 0.25: IC302.14_PB0 16,18.75 17.5,20.25 25,20.25 25.75,21 25.75,27.5 27.23,28.98 JP501.1
PB1
  Top 0.25: JP501.2 28.75,31.52 25.25,28.02 25.25,21.25 24.75,20.75 17.25,20.75 15.42,18.92 IC302.15_PB1
PB3
  Top 0.25: IC302.24_PB3 17,10.25 14.5,7.75 12.11,7.75 11.36,7 JP502.1
PB4
  Top 0.25: IC302.25_PB4 17.5,10 13.9,6.4 JP502.2
PB5
  Top 0.25: IC302.26_PB5 18,9.75 16.44,8.19 JP502.3
PB6
  Top 0.25: JP502.4 18.5,5.73 IC302.27_PB6
PB7
  Top 0.25: JP502.5 21.52,7.23 19,9.75 IC302.28_PB7
PB8
  Top 0.25: IC302.1_PB8 19.5,13.17 19.5,10 21.75,7.75 23.25,7.75 24.06,6.94 JP502.6
PF0
  Top 0.25: JP502.7 26.6,6.65 23.98,9.27 23.98,12.27 22.5,13.75 IC302.2_PF0
PF1
  Top 0.25: IC302.3_PF1 22.75,14.25 24.48,12.52 24.48,10.52 29.14,5.86 JP502.8
POWER_3V3:CD
  Top 0.25: IC201.5_CD 19.2,26.05 C201.1
POWER_3V3:EN
  Top 0.25: R201.2 15.5,26.5 15.95,26.05 IC201.4_DOUT IC202.EN
SYS_NRST  (via drill 0.35)
  Top 0.25: v18.5,14.75 IC302.4_NRST | J1.12 v8,4.5
  Bottom 0.25: v8,4.5 8,5.5 12.9,10.4 C307.2 16.5,11.25 18.5,13.25 v18.5,14.75
  other vias: 12.9,11.25
SYS_SWCLK
  Top 0.25: IC302.22_PA14 16,10 14.25,8.25 8.05,8.25 J1.6
SYS_SWDIO
  Top 0.25: IC302.21_PA13 15.5,13.17 15.5,10.25 14.75,9.5 8.07,9.5 J1.4

### Text on the board
tPlace: GND | BAT+ | PB1 | 3V3 | GND | PB0 | H | CAN | L | PA7 | PA6 | PA5 | PA4 | PA3 | PA2 | PA1 | PA0 | PB3 | PB4 | PB5 | PB6 | PB7 | PB8 | PF0 | PF1
bPlace: PB1 | PB0 | PA7 | PA6 | PA5 | PA4 | PA3 | PA2 | PA1 | PA0 | PB3 | PB4 | PB5 | PB6 | PB7 | PB8 | PF0 | PF1
tStop: MJfoo / ejovrh rev.1b